# Altium project CMM_MACHINE.PrjPcb
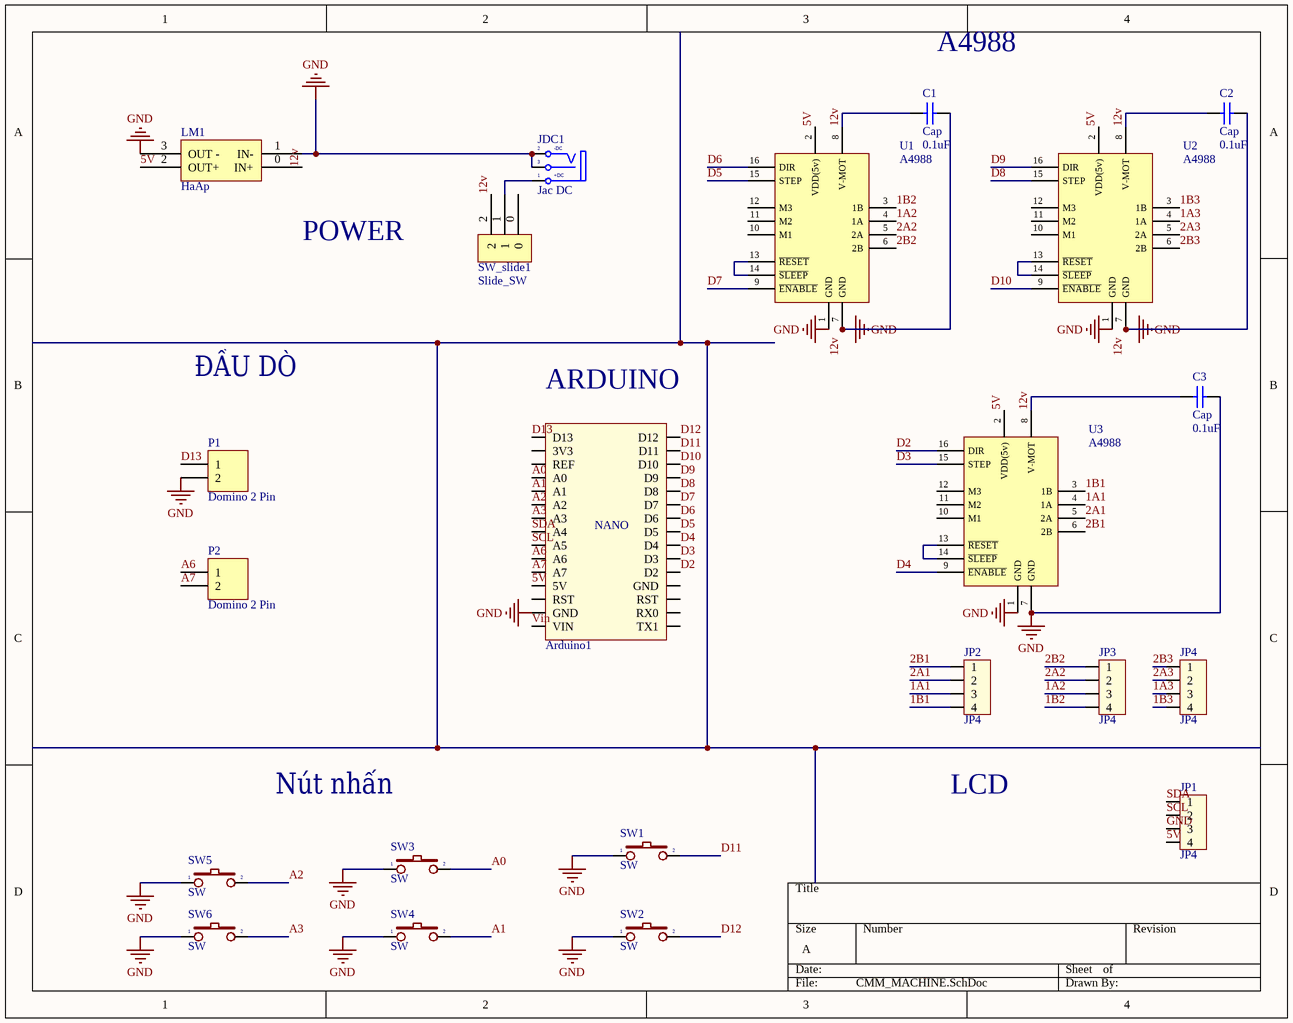
[diagram p0: CMM_MACHINE.SchDoc]
1 sheet, 22 parts. Net scope: global (net labels, ports and power ports of the same name join across sheets).
Board file: CMM_MACHINE.PcbDoc

## Sheet CMM_MACHINE.SchDoc
size A

### Parts
Arduino1  Arduino Nano  [Arduino Nano]  (value not drawn)
C1  Cap  value 0.1uF  [C3MM]
C2  Cap  value 0.1uF  [C3MM]
C3  Cap  value 0.1uF  [C3MM]
JDC1  Jac DC  [DC0]
JP1  JP4  [CON4]
JP2  JP4  [CON4]
JP3  JP4  [CON4]
JP4  JP4  [CON4]
LM1  HaAp  [BUCK_LM2596]
P1  Domino 2 Pin  [DOMINO_2PIN_5.08mm]
P2  Domino 2 Pin  [DOMINO_2PIN_5.08mm]
SW1  SW  [SW2]
SW2  SW  [SW2]
SW3  SW  [SW2]
SW4  SW  [SW2]
SW5  SW  [SW2]
SW6  SW  [SW2]
SW_slide1  Slide_SW  [Slide_SW]
U1  A4988  [A4988(driver)]
U2  A4988  [A4988(driver)]
U3  A4988  [A4988(driver)]

### Nets
GND: Arduino1.GND C1.1 C2.1 C3.1 JDC1.2(TN) JDC1.3(S) JP1.3 LM1.1(IN-) LM1.3(OUT_-) P1.2 SW1.1 SW2.1 SW3.1 SW4.1 SW5.1 SW6.1 U1.1(GND) U1.7(GND) U2.1(GND) U2.7(GND) U3.1(GND) U3.7(GND)
1A1: JP2.3 U3.4(1A)
1A2: JP3.3 U1.4(1A)
1A3: JP4.3 U2.4(1A)
1B1: JP2.4 U3.3(1B)
1B2: JP3.4 U1.3(1B)
1B3: JP4.4 U2.3(1B)
2A1: JP2.2 U3.5(2A)
2A2: JP3.2 U1.5(2A)
2A3: JP4.2 U2.5(2A)
2B1: JP2.1 U3.6(2B)
2B2: JP3.1 U1.6(2B)
2B3: JP4.1 U2.6(2B)
5V: Arduino1.5V JP1.4 LM1.2(OUT+) U1.2(VDD(5v)) U2.2(VDD(5v)) U3.2(VDD(5v))
12v: C1.2 C2.2 C3.2 LM1.0(IN+) SW_slide1.2 U1.8(V-MOT) U2.8(V-MOT) U3.8(V-MOT)
A0: Arduino1.A0 SW3.2
A1: Arduino1.A1 SW4.2
A2: Arduino1.A2 SW5.2
A3: Arduino1.A3 SW6.2
A6: Arduino1.A6 P2.1
A7: Arduino1.A7 P2.2
D2: Arduino1.D2 U3.16(DIR)
D3: Arduino1.D3 U3.15(STEP)
D4: Arduino1.D4 U3.9(~{ENABLE})
D5: Arduino1.D5 U1.15(STEP)
D6: Arduino1.D6 U1.16(DIR)
D7: Arduino1.D7 U1.9(~{ENABLE})
D8: Arduino1.D8 U2.15(STEP)
D9: Arduino1.D9 U2.16(DIR)
D10: Arduino1.D10 U2.9(~{ENABLE})
D11: Arduino1.D11 SW1.2
D12: Arduino1.D12 SW2.2
D13: Arduino1.D13 P1.1
SCL: Arduino1.A5 JP1.2
SDA: Arduino1.A4 JP1.1
Vin: Arduino1.VIN
NetJDC1_1: JDC1.1(T) SW_slide1.1
NetU1_13: U1.13(~{RESET}) U1.14(~{SLEEP})
NetU2_13: U2.13(~{RESET}) U2.14(~{SLEEP})
NetU3_13: U3.13(~{RESET}) U3.14(~{SLEEP})

Not connected (* = marked no-connect by the designer): Arduino1 3V3 REF RST RX0 TX1; SW_slide1 0; U1 10(M1) 11(M2) 12(M3); U2 10(M1) 11(M2) 12(M3); U3 10(M1) 11(M2) 12(M3)

### Notes on the sheet
- A4988
- POWER
- ĐẦU DÒ
- (near Arduino1) ARDUINO
- Nút nhấn
- LCD
- Labels drawn without touching a wire or pin: 12v
- (in symbol Arduino Nano) NANO
- (in symbol DCIN) -DC; +DC

### Library data of the parts
Arduino1 = Arduino Nano: Value: Cau 1A
C1-C3 = Cap: Capacitor; Published: 8-Jun-2000; LatestRevisionDate: 17-Jul-2002; LatestRevisionNote: Re-released for DXP Platform.; PackageReference: RAD-0.3; Publisher: Altium Limited
JDC1 = DCIN: Jac DC input; Value: Jac DC
JP1-JP4 = Con4: Connector 4; Value: Connector 4
LM1 = BUCK_LM2596
SW1-SW6 = SW2: Switch button 2 pin; Value: SW chip 2 pin